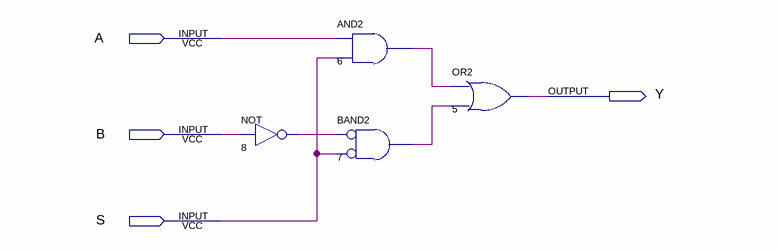
[diagram p0: schematic sheet]
// Quartus schematic mux21.bdf as structural Verilog: 4 symbols, 4 pins
module mux21 (
  input  A,
  input  B,
  input  S,
  output Y
);

  wire n6_out, n7_out, n8_out;

  not u_8 (n8_out, B);
  and u_6 (n6_out, A, S);
  and u_7 (n7_out, ~n8_out, ~S);  // BAND2
  or u_5 (Y, n6_out, n7_out);
endmodule
